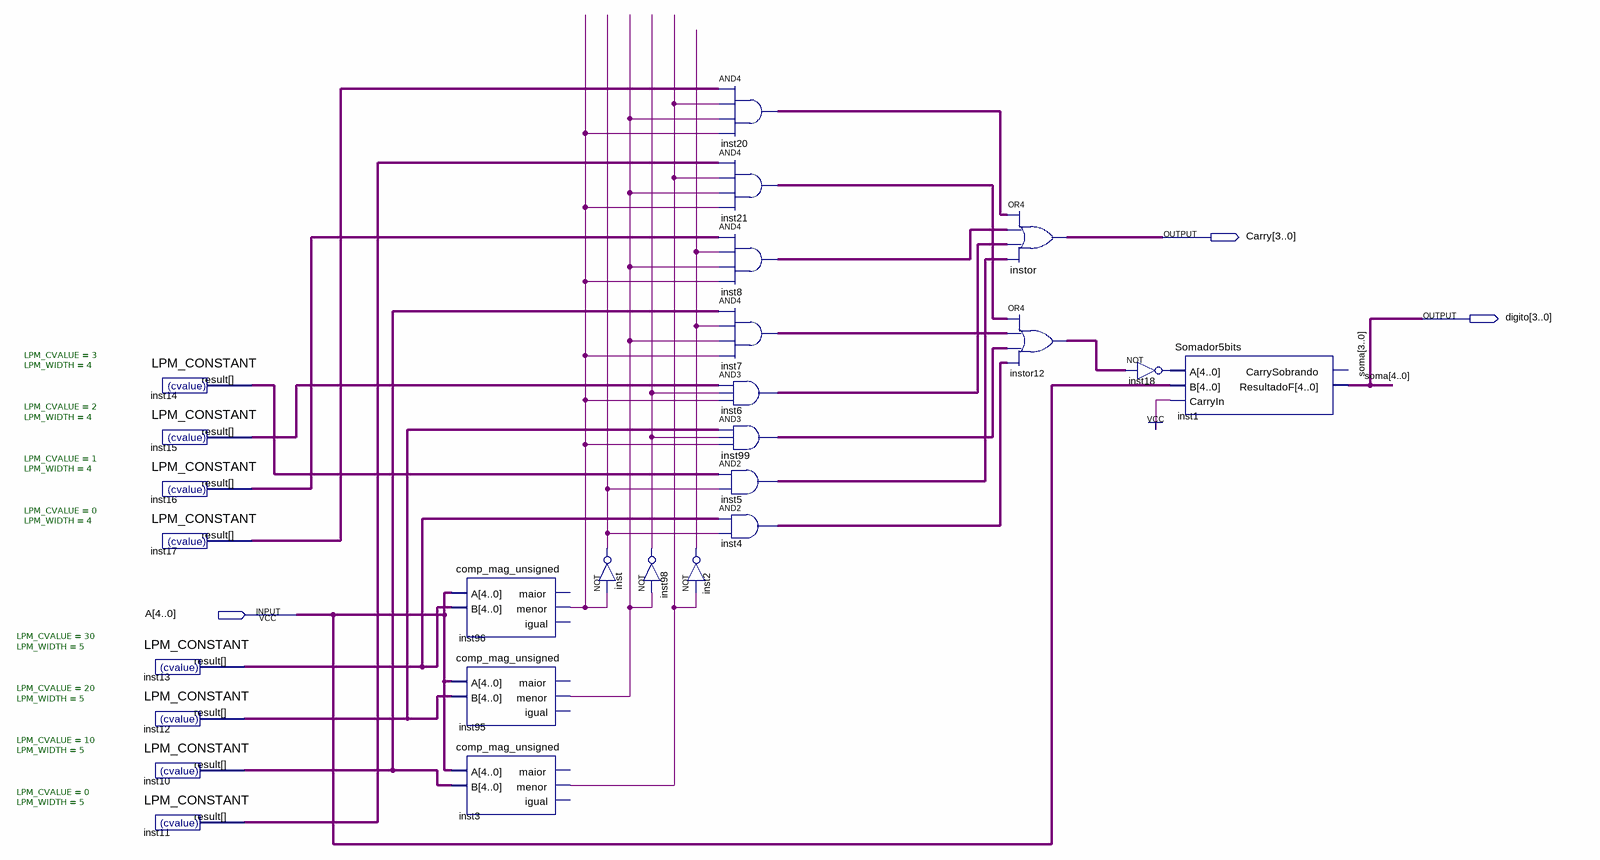
[diagram p0: schematic sheet]
// Quartus schematic decimal_sep_5bits.bdf as structural Verilog: 26 symbols, 3 pins
module decimal_sep_5bits (
  input  [4:0] A,
  output [3:0] Carry,
  output [3:0] digito
);

  wire inst2_out, inst3_menor, inst95_menor, inst96_menor, inst98_out, inst_out;
  wire [3:0] inst5_out, inst6_out, inst8_out, inst14_result, inst15_result, inst16_result, inst17_result,
       inst20_out;
  wire [4:0] inst4_out, inst7_out, inst10_result, inst11_result, inst12_result, inst13_result, inst18_out,
       inst21_out, inst99_out, instor12_out;
  wire [4:4] soma;

  LPM_CONSTANT #(.LPM_CVALUE(3), .LPM_WIDTH(4)) inst14 (.result(inst14_result));
  LPM_CONSTANT #(.LPM_CVALUE(2), .LPM_WIDTH(4)) inst15 (.result(inst15_result));
  LPM_CONSTANT #(.LPM_CVALUE(1), .LPM_WIDTH(4)) inst16 (.result(inst16_result));
  LPM_CONSTANT #(.LPM_CVALUE(0), .LPM_WIDTH(4)) inst17 (.result(inst17_result));
  LPM_CONSTANT #(.LPM_CVALUE(30), .LPM_WIDTH(5)) inst13 (.result(inst13_result));
  LPM_CONSTANT #(.LPM_CVALUE(20), .LPM_WIDTH(5)) inst12 (.result(inst12_result));
  LPM_CONSTANT #(.LPM_CVALUE(10), .LPM_WIDTH(5)) inst10 (.result(inst10_result));
  LPM_CONSTANT #(.LPM_CVALUE(0), .LPM_WIDTH(5)) inst11 (.result(inst11_result));
  comp_mag_unsigned inst96 (.A(A), .B(inst13_result), .menor(inst96_menor));  // open: maior, igual
  comp_mag_unsigned inst95 (.A(A), .B(inst12_result), .menor(inst95_menor));  // open: maior, igual
  comp_mag_unsigned inst3 (.A(A), .B(inst10_result), .menor(inst3_menor));  // open: maior, igual
  not inst (inst_out, inst96_menor);
  not inst2 (inst2_out, inst3_menor);
  not inst98 (inst98_out, inst95_menor);
  assign inst20_out = inst17_result & {4{inst3_menor}} & {4{inst95_menor}} & {4{inst96_menor}};  // AND4 inst20, 4 bits wide
  assign inst21_out = inst11_result & {5{inst3_menor}} & {5{inst95_menor}} & {5{inst96_menor}};  // AND4 inst21, 5 bits wide
  assign inst8_out = inst16_result & {4{inst2_out}} & {4{inst95_menor}} & {4{inst96_menor}};  // AND4 inst8, 4 bits wide
  assign inst7_out = inst10_result & {5{inst2_out}} & {5{inst95_menor}} & {5{inst96_menor}};  // AND4 inst7, 5 bits wide
  assign inst6_out = inst15_result & {4{inst98_out}} & {4{inst96_menor}};  // AND3 inst6, 4 bits wide
  assign inst99_out = inst12_result & {5{inst98_out}} & {5{inst96_menor}};  // AND3 inst99, 5 bits wide
  assign inst5_out = inst14_result & {4{inst_out}};  // AND2 inst5, 4 bits wide
  assign inst4_out = inst13_result & {5{inst_out}};  // AND2 inst4, 5 bits wide
  assign Carry = inst20_out | inst8_out | inst6_out | inst5_out;  // OR4 instor, 4 bits wide
  assign instor12_out = inst21_out | inst7_out | inst99_out | inst4_out;  // OR4 instor12, 5 bits wide
  assign inst18_out = ~instor12_out;  // NOT inst18, 5 bits wide
  Somador5bits inst1 (.A(inst18_out), .B(A), .CarryIn(1'b1), .ResultadoF({soma[4], digito}));  // open: CarrySobrando

  // Other names for the same wires on the sheet: soma[3:0] = digito
endmodule
